# EAGLE design calefactor (EAGLE 9.6.2)
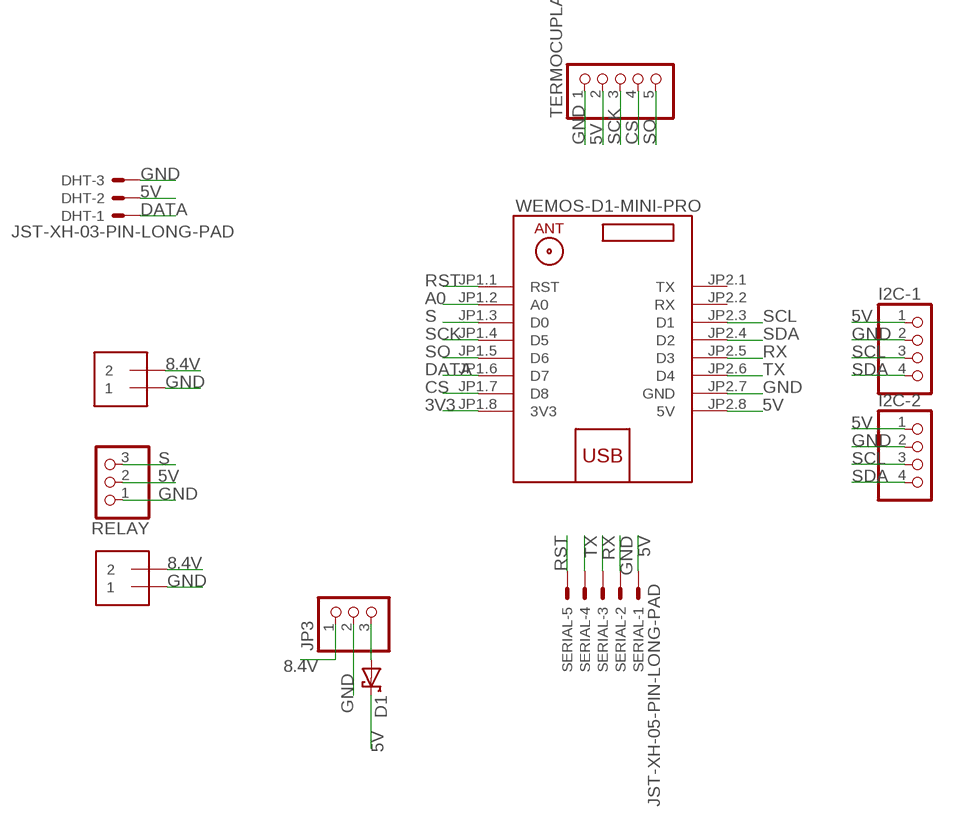
[diagram p0: schematic, sheet 1]

## Parts
D1  SCHOTTKY-DIODEDO41-7  [DO41-7]
DHT  JST-XH-03-PIN-LONG-PAD  [JST-XH-03-PACKAGE-LONG-PAD]
I2C-1  PINHD-1X4  [1X04]
I2C-2  PINHD-1X4  [1X04]
J1  1X2-3.5MM  [1X2-3.5MM]
J2  1X2-3.5MM  [1X2-3.5MM]
JP3  PINHD-1X3  [1X03]
RELAY  PINHD-1X3  [1X03]
SERIAL  JST-XH-05-PIN-LONG-PAD  [JST-XH-05-PACKAGE-LONG-PAD]
TERMOCUPLA  PINHD-1X5  [1X05]
U$1  WEMOS-D1-MINI-PRO  [WEMOS-D1-MINI-PRO]

## Nets
3V3: U$1.JP1.8(3V3)
5V: D1.C DHT.2 I2C-1.1 I2C-2.1 RELAY.2 SERIAL.1 TERMOCUPLA.2 U$1.JP2.8(5V)
8.4V: J1.2 J2.2 JP3.1
A0: U$1.JP1.2(A0)
CS: TERMOCUPLA.4 U$1.JP1.7(D8)
DATA: DHT.1 U$1.JP1.6(D7)
GND: DHT.3 I2C-1.2 I2C-2.2 J1.1 J2.1 JP3.2 RELAY.1 SERIAL.2 TERMOCUPLA.1 U$1.JP2.7(GND)
N$1: D1.A JP3.3
RST: SERIAL.5 U$1.JP1.1(RST)
RX: SERIAL.3 U$1.JP2.5(D3)
S: RELAY.3 U$1.JP1.3(D0)
SCK: TERMOCUPLA.3 U$1.JP1.4(D5)
SCL: I2C-1.3 I2C-2.3 U$1.JP2.3(D1)
SDA: I2C-1.4 I2C-2.4 U$1.JP2.4(D2)
SO: TERMOCUPLA.5 U$1.JP1.5(D6)
TX: SERIAL.4 U$1.JP2.6(D4)
Unconnected: U$1.JP2.1(TX) U$1.JP2.2(RX)

## Library data of the parts
D1 = adafruit:SCHOTTKY-DIODE: Schottky Diode
DHT = Rembrandt Electronics - JST XH Connectors v1-0:JST-XH-03-PIN: JST XH Connector 2 Pin Wire to board connector. Pitch: 2,54 mm, (0.100") Number of pins: 3 Created by Rembrandt Electronics www.rembrandtelectronics.com
I2C-1 I2C-2 = pinhead:PINHD-1X4: PIN HEADER
J1 J2 = adafruit:1X2: 3.5mm Terminal block http://www.ladyada.net/library/pcb/eaglelibrary.html
JP3 RELAY = pinhead:PINHD-1X3: PIN HEADER
SERIAL = Rembrandt Electronics - JST XH Connectors v1-0:JST-XH-05-PIN: JST XH Connector 2 Pin Wire to board connector. Pitch: 2,54 mm, (0.100") Number of pins: 5 Created by Rembrandt Electronics www.rembrandtelectronics.com
TERMOCUPLA = pinhead:PINHD-1X5: PIN HEADER
U$1 = diy-modules:WEMOS-D1-MINI-PRO: WEMOS D1 mini Pro: Mini Wi-Fi Board based on ESP-8266EX chip More details can be found here: https://www.wemos.cc/product/d1-mini-pro.html Click here to find device on ebay.com <http://www.ebay.com/sch/wemos+d1+mini+pro>

## Board
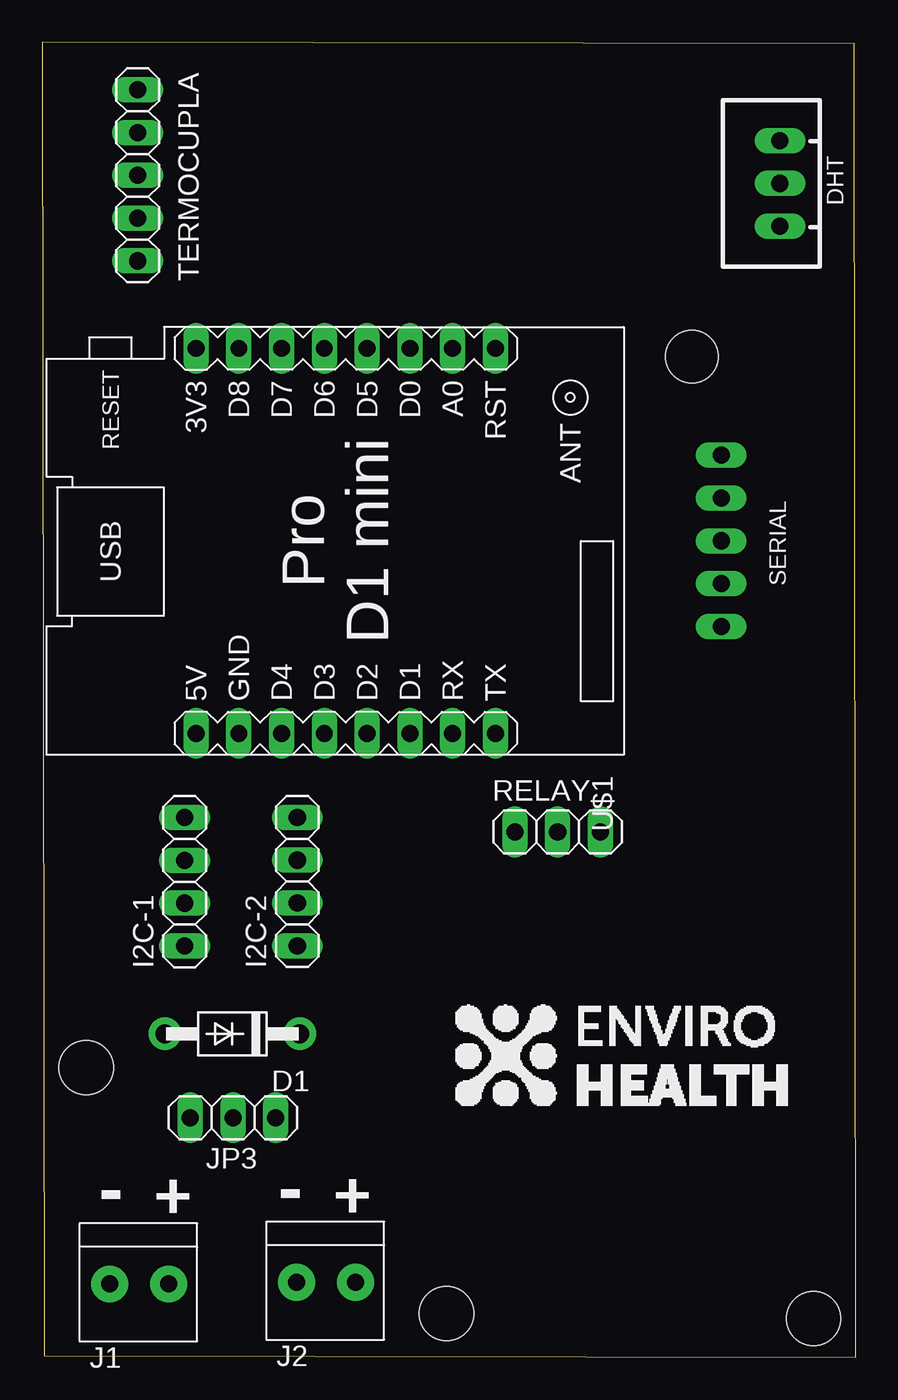
[diagram p1: board, top side]
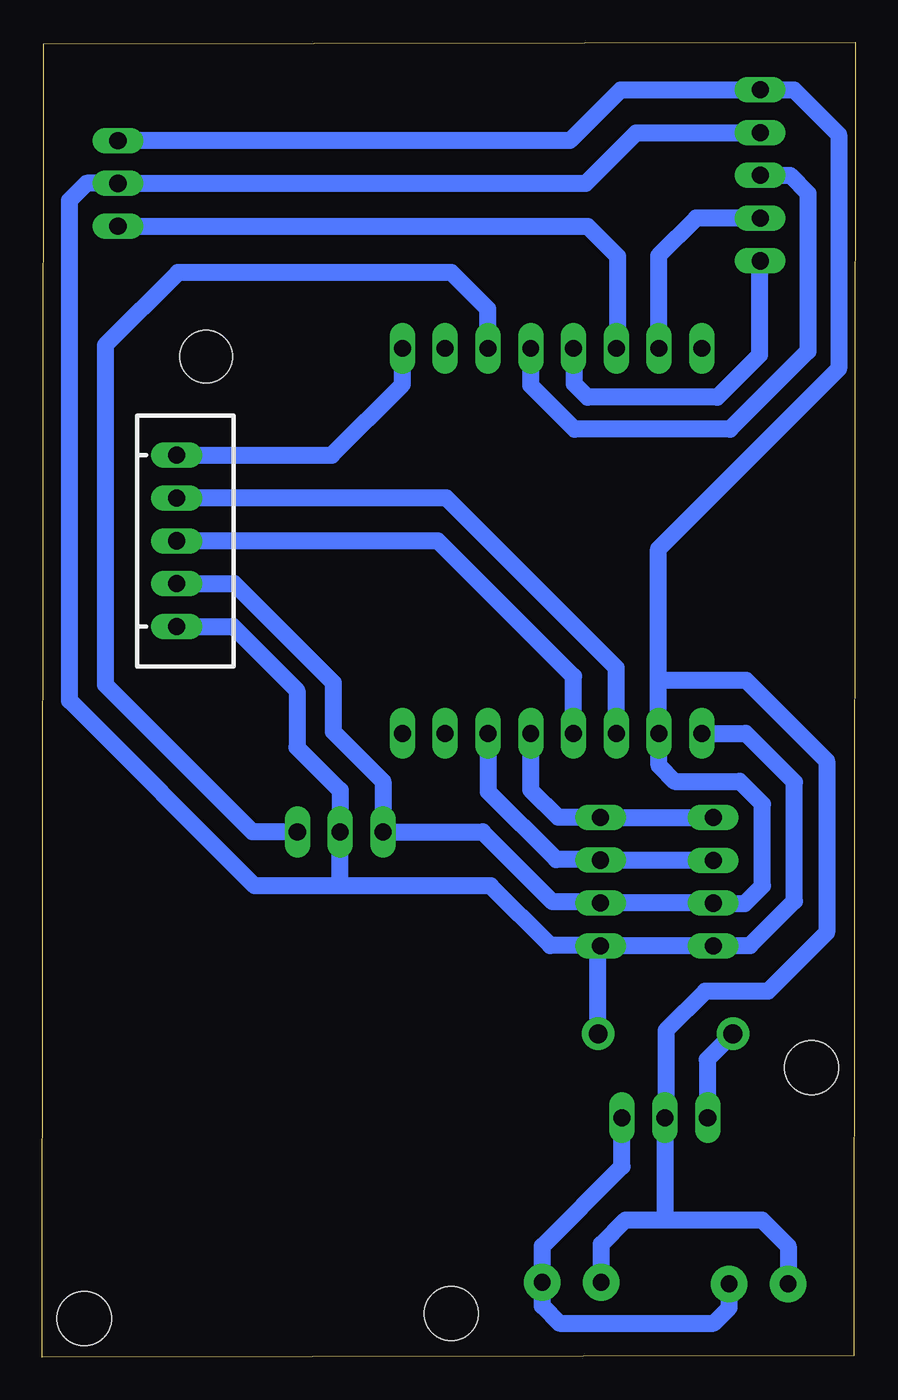
[diagram p2: board, bottom side, seen from below]

Size 48.3 x 78.09 mm. Coordinates in mm from the lower left corner, seen from the top.
Outline: 0.1,0.1 48.3,0 48.2,77.99 0,78.09 0.1,0.1
Copper layers (1*16): Top 0.035mm / dielectric 1.5mm / Bottom 0.035mm
Design rules "default *": minimum track width 0.8mm, minimum drill 0.35mm, track to track 0.8mm, track to pad 0.8mm, pad to pad 0.8mm, via to via 0.8mm, smd to smd 6mil, copper to edge 40mil, drill to drill 6mil, minimum pad ring 10mil, minimum via ring 8mil, stop-mask expansion 4mil, vias tented up to drill 0mil, thermal gap 10mil
Holes 3.1 mm at 38.56,59.41
Holes 3.2 mm at 45.8,2.3 24,2.6 2.6,17.2

### Footprints (pad centres in the part's own frame; a part is rotated, then mirrored left to right if it is on the bottom)
DO41-7 = drill 1.118 pad 1.93: A 4,0; C -4,0
JST-XH-03-PACKAGE-LONG-PAD = drill 1.016 long: 1 -2.54,0; 2 0,0; 3 2.54,0
1X04 = drill 1.016 long: 1 -3.81,0; 2 -1.27,0; 3 1.27,0; 4 3.81,0
1X2-3.5MM = drill 1 pad 2.184: 1 1.8,0; 2 -1.7,0
1X03 = drill 1.016 long: 1 -2.54,0; 2 0,0; 3 2.54,0
JST-XH-05-PACKAGE-LONG-PAD = drill 1.016 long: 1 -5.08,0; 2 -2.54,0; 3 0,0; 4 2.54,0; 5 5.08,0
1X05 = drill 1.016 long: 1 -5.08,0; 2 -2.54,0; 3 0,0; 4 2.54,0; 5 5.08,0
WEMOS-D1-MINI-PRO = drill 1 long: JP1.1 -11.43,9.525; JP1.2 -11.43,6.985; JP1.3 -11.43,4.445; JP1.4 -11.43,1.905; JP1.5 -11.43,-0.635; JP1.6 -11.43,-3.175; JP1.7 -11.43,-5.715; JP1.8 -11.43,-8.255; JP2.1 11.43,9.525; JP2.2 11.43,6.985; JP2.3 11.43,4.445; JP2.4 11.43,1.905; JP2.5 11.43,-0.635; JP2.6 11.43,-3.175; JP2.7 11.43,-5.715; JP2.8 11.43,-8.255

### Placement (x,y rotation side)
D1  11.28,19.21 180 top
DHT  43.8,69.7 90 top
I2C-1  8.45,28.24 90 top
I2C-2  15.14,28.25 90 top
J1  5.8,4.36 180 top
J2  16.9,4.46 180 top
JP3  11.32,14.23 180 top
RELAY  30.6,31.2 0 top
SERIAL  40.31,48.48 90 top
TERMOCUPLA  5.66,70.18 270 top
U$1  17.38,48.48 270 top

### Tracks (layer width: path | path; a pad name or v marks a point on that pad's centre or on a via)
5V
  Bottom 1.016: 30.6,28 RELAY.2 30.6,33.66 33.16,36.22 33.16,39.59 36.97,43.4 SERIAL.1 | TERMOCUPLA.2 5.68,72.7 13.02,72.7 16.02,69.7 DHT.2 45.66,69.7 46.66,68.7 46.66,38.99 35.68,28 30.6,28 | 30.6,28 21.67,28 18.12,24.45 I2C-2.1 | I2C-2.1 8.47,24.45 I2C-1.1 8.43,24.45 6.26,24.45 3.63,27.09 3.63,34.16 6.52,37.05 U$1.JP2.8 | D1.C 15.28,24.44 I2C-2.1
8.4V
  Bottom 1.016: J1.2 7.5,2.96 8.42,2.04 17.58,2.04 18.6,3.06 J2.2 18.6,6.6 13.86,11.34 JP3.1
CS
  Bottom 0.8: 11.7,59.94 U$1.JP1.7
  Bottom 1.016: TERMOCUPLA.4 9.46,67.64 11.7,65.4 11.7,59.94
DATA
  Bottom 0.8: 14.13,59.98 U$1.JP1.6
  Bottom 1.016: DHT.1 15.91,67.16 14.13,65.38 14.13,59.98
GND
  Bottom 1.016: DHT.3 16.96,72.24 13.94,75.26 TERMOCUPLA.1 3.66,75.26 1,72.6 1,58.7 11.7,48 11.7,40.2 | 11.7,40.2 6.49,40.2 1.71,35.42 1.71,25.23 5.2,21.74 8.92,21.74 11.25,19.41 11.25,14.3 JP3.2 | 11.7,40.2 11.7,37.09 U$1.JP2.7 11.66,35.13 10.74,34.2 6.88,34.2 5.53,32.86 5.53,28 6.57,26.95 8.43,26.95 I2C-1.2 I2C-2.2 15.21,27.05 17.99,27.05 22.14,31.2 RELAY.1 28.06,34.2 31.01,37.15 31.01,40.06 36.9,45.95 SERIAL.2 | 11.28,14.19 JP3.2 | JP3.2 11.31,8.37 11.1,8.16 | J1.1 4,6.61 5.55,8.16 11.1,8.16 | J2.1 15.1,6.72 13.66,8.16 11.1,8.16
N$1
  Bottom 1.016: D1.A 8.8,17.69 8.8,14.25 JP3.3
RST
  Bottom 1.016: SERIAL.5 31.11,53.56 26.91,57.77 U$1.JP1.1
RX
  Bottom 1.016: U$1.JP2.5 16.74,40.43 24.8,48.48 SERIAL.3
S
  Bottom 1.016: RELAY.3 35.8,31.2 44.54,39.94 44.54,60.1 40.23,64.41 23.99,64.41 21.83,62.24 U$1.JP1.3
SCK
  Bottom 1.016: 5.68,70.2 TERMOCUPLA.3 3.88,70.18 2.82,69.12 2.82,59.74 7.45,55.1 16.68,55.1 19.29,57.71 U$1.JP1.4 19.3,59.92
SCL
  Bottom 1.016: U$1.JP2.3 21.8,37.03 21.8,33.58 17.77,29.55 15.17,29.55 I2C-2.3 I2C-1.3
SDA
  Bottom 1.016: U$1.JP2.4 19.29,33.7 17.65,32.06 I2C-2.4 I2C-1.4
SO
  Bottom 1.016: U$1.JP1.5 16.7,59.86 16.7,57.79 15.91,57 8.22,57 5.7,59.52 5.7,65.06 TERMOCUPLA.5
TX
  Bottom 1.016: U$1.JP2.6 14.2,40.93 24.29,51.02 SERIAL.4